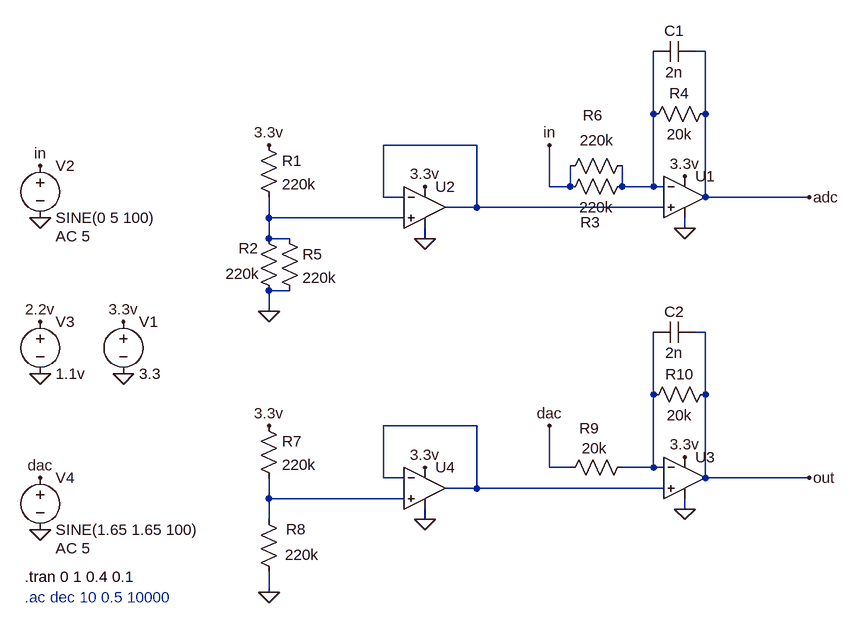
[diagram p0: schematic Active Filter.asc]
Active Filter.asc, the LTspice schematic file:
Version 4
SHEET 1 1292 916
WIRE 560 -16 544 -16
WIRE 480 80 480 -16
WIRE 560 80 560 -16
WIRE 208 128 64 128
WIRE 320 192 320 128
WIRE 352 192 352 160
WIRE 352 192 320 192
WIRE 432 192 432 160
WIRE 480 192 480 80
WIRE 480 192 432 192
WIRE 496 192 480 192
WIRE 64 208 64 128
WIRE 96 208 64 208
WIRE 560 208 560 80
WIRE 720 208 560 208
WIRE 208 224 208 128
WIRE 208 224 160 224
WIRE 496 224 208 224
WIRE -112 240 -112 208
WIRE 96 240 -112 240
WIRE 528 256 528 240
WIRE -112 272 -112 240
WIRE -80 272 -112 272
WIRE 128 272 128 256
WIRE -80 352 -112 352
WIRE -112 384 -112 352
WIRE 560 416 544 416
WIRE 480 512 480 416
WIRE 560 512 560 416
WIRE 208 560 64 560
WIRE 320 624 320 560
WIRE 352 624 320 624
WIRE 480 624 480 512
WIRE 480 624 432 624
WIRE 496 624 480 624
WIRE 64 640 64 560
WIRE 96 640 64 640
WIRE 560 640 560 512
WIRE 720 640 560 640
WIRE 208 656 208 560
WIRE 208 656 160 656
WIRE 496 656 208 656
WIRE -112 672 -112 640
WIRE 96 672 -112 672
WIRE 528 688 528 672
WIRE -112 704 -112 672
WIRE 128 704 128 688
WIRE -112 816 -112 784
FLAG -112 384 0
FLAG -112 128 3.3v
FLAG 528 176 3.3v
FLAG 320 128 in
FLAG -336 480 0
FLAG -336 400 3.3v
FLAG -464 240 0
FLAG -464 160 in
FLAG -464 480 0
FLAG -464 400 2.2v
FLAG 128 192 3.3v
FLAG -464 720 0
FLAG -464 640 dac
FLAG 128 272 0
FLAG 528 256 0
FLAG 720 208 adc
FLAG -112 816 0
FLAG -112 560 3.3v
FLAG 528 608 3.3v
FLAG 128 624 3.3v
FLAG 128 704 0
FLAG 528 688 0
FLAG 720 640 out
FLAG 320 560 dac
SYMBOL res -128 112 R0
SYMATTR InstName R1
SYMATTR Value 220k
SYMBOL res -128 256 R0
WINDOW 0 -31 31 Left 2
WINDOW 3 -51 70 Left 2
SYMATTR InstName R2
SYMATTR Value 220k
SYMBOL res 448 176 R90
WINDOW 0 86 65 VBottom 2
WINDOW 3 32 56 VTop 2
SYMATTR InstName R3
SYMATTR Value 220k
SYMBOL res 576 64 R90
WINDOW 0 0 56 VBottom 2
WINDOW 3 32 56 VTop 2
SYMATTR InstName R4
SYMATTR Value 20k
SYMBOL cap 544 -32 R90
WINDOW 0 0 32 VBottom 2
WINDOW 3 32 32 VTop 2
SYMATTR InstName C1
SYMATTR Value 2n
SYMBOL voltage -336 384 R0
WINDOW 123 0 0 Left 2
WINDOW 39 0 0 Left 2
SYMATTR InstName V1
SYMATTR Value 3.3
SYMBOL voltage -464 144 R0
WINDOW 123 24 124 Left 2
WINDOW 39 0 0 Left 2
SYMATTR Value2 AC 5
SYMATTR InstName V2
SYMATTR Value SINE(0 5 100)
SYMBOL Opamps\\UniversalOpamp2 528 208 R0
SYMATTR InstName U1
SYMBOL voltage -464 384 R0
WINDOW 123 0 0 Left 2
WINDOW 39 0 0 Left 2
SYMATTR InstName V3
SYMATTR Value 1.1v
SYMBOL Opamps\\UniversalOpamp2 128 224 R0
SYMATTR InstName U2
SYMBOL voltage -464 624 R0
WINDOW 123 24 124 Left 2
WINDOW 39 0 0 Left 2
SYMATTR Value2 AC 5
SYMATTR InstName V4
SYMATTR Value SINE(1.65 1.65 100)
SYMBOL res -96 256 R0
SYMATTR InstName R5
SYMATTR Value 220k
SYMBOL res 448 144 R90
WINDOW 0 -46 61 VBottom 2
WINDOW 3 -39 55 VTop 2
SYMATTR InstName R6
SYMATTR Value 220k
SYMBOL res -128 544 R0
SYMATTR InstName R7
SYMATTR Value 220k
SYMBOL res -128 688 R0
WINDOW 0 42 31 Left 2
WINDOW 3 41 70 Left 2
SYMATTR InstName R8
SYMATTR Value 220k
SYMBOL res 448 608 R90
WINDOW 0 -29 67 VBottom 2
WINDOW 3 -29 59 VTop 2
SYMATTR InstName R9
SYMATTR Value 20k
SYMBOL res 576 496 R90
WINDOW 0 0 56 VBottom 2
WINDOW 3 32 56 VTop 2
SYMATTR InstName R10
SYMATTR Value 20k
SYMBOL cap 544 400 R90
WINDOW 0 0 32 VBottom 2
WINDOW 3 32 32 VTop 2
SYMATTR InstName C2
SYMATTR Value 2n
SYMBOL Opamps\\UniversalOpamp2 528 640 R0
SYMATTR InstName U3
SYMBOL Opamps\\UniversalOpamp2 128 656 R0
SYMATTR InstName U4
TEXT -488 824 Left 2 ;.ac dec 10 0.5 10000
TEXT -488 792 Left 2 !.tran 0 1 0.4 0.1

The netlist it stands for:
* Active Filter.asc
R1 3.3v N003 220k
R2 N003 0 220k
R3 N001 in 220k
R4 adc N001 20k
C1 adc N001 2n
V1 3.3v 0 3.3
V2 in 0 SINE(0 5 100) AC 5
XU1 N002 N001 3.3v 0 adc level.2 Avol=1Meg GBW=10Meg Slew=10Meg ilimit=25m rail=0 Vos=0 phimargin=45 en=0 enk=0 in=0 ink=0 Rin=500Meg  ; pins IN+ IN- V+ V- OUT
V3 2.2v 0 1.1v
XU2 N003 N002 3.3v 0 N002 level.2 Avol=1Meg GBW=10Meg Slew=10Meg ilimit=25m rail=0 Vos=0 phimargin=45 en=0 enk=0 in=0 ink=0 Rin=500Meg  ; pins IN+ IN- V+ V- OUT
V4 dac 0 SINE(1.65 1.65 100) AC 5
R5 N003 0 220k
R6 N001 in 220k
R7 3.3v N006 220k
R8 N006 0 220k
R9 N004 dac 20k
R10 out N004 20k
C2 out N004 2n
XU3 N005 N004 3.3v 0 out level.2 Avol=1Meg GBW=10Meg Slew=10Meg ilimit=25m rail=0 Vos=0 phimargin=45 en=0 enk=0 in=0 ink=0 Rin=500Meg  ; pins IN+ IN- V+ V- OUT
XU4 N006 N005 3.3v 0 N005 level.2 Avol=1Meg GBW=10Meg Slew=10Meg ilimit=25m rail=0 Vos=0 phimargin=45 en=0 enk=0 in=0 ink=0 Rin=500Meg  ; pins IN+ IN- V+ V- OUT
* .ac dec 10 0.5 10000
.tran 0 1 0.4 0.1
.lib UniversalOpamps2.sub
.backanno
.end